# Altium schematic sheet Stepper_motor_driver.SchDoc
size A4; PageSetup: Record=PageOptions|CenterHorizontal=True|CenterVertical=True|PrintScale=1.00|XCorrection=1.00|YCorrection=1.00|PrintKind=0|BorderSize=5000000|LeftOffset=0|BottomOffset=0|Orientation=2|PaperLength=1000|PaperWidth=1000|Scale=100|PaperSource=7|PrintQuality=-3|MediaType=1|DitherType=10|PrintScaleMode=1|PaperKind=A4|PaperIndex=9
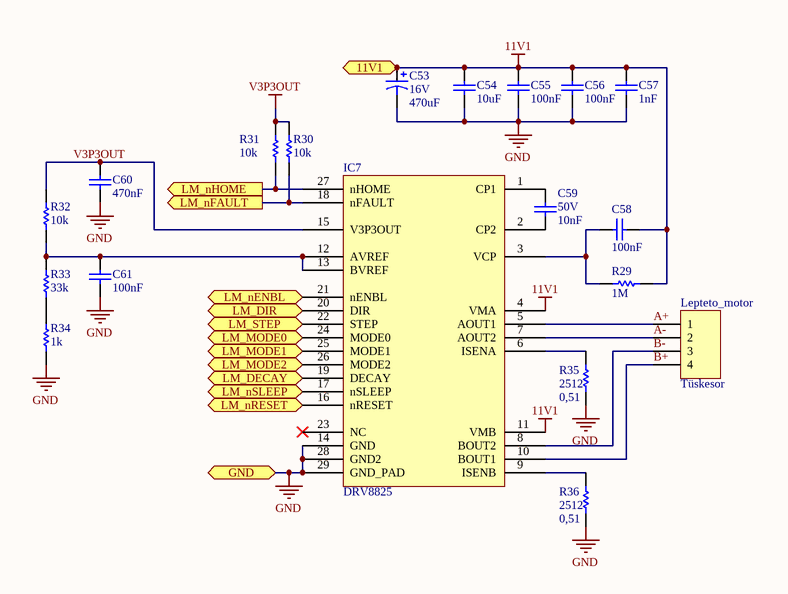
[diagram p0: Stepper_motor_driver.SchDoc]

## Parts
C53  16V  value 470uF  [power_cap_10mm]
C54  value 10uF  [FP_1206_CAP_125]  (hidden comment: 50V)
C55  value 100nF  [FP_0603_CAP_080]  (hidden comment: 50V)
C56  value 100nF  [FP_0603_CAP_080]  (hidden comment: 50V)
C57  value 1nF  [FP_0603_CAP_080]  (hidden comment: 50V)
C58  value 100nF  [FP_0603_CAP_080]  (hidden comment: 16V)
C59  50V  value 10nF  [FP_0603_CAP_080]
C60  value 470nF  [FP_0603_CAP_080]  (hidden comment: 50V)
C61  value 100nF  [FP_0603_CAP_080]  (hidden comment: 50V)
IC7  DRV8825  [TSSOP28_thermal_pad]
Lepteto_motor  Tüskesor  [FP_CONN4_TUSKE_254MM]
R29  value 1M  [FP_0603_RES]  (hidden comment: Res1)
R30  value 10k  [FP_0603_RES]  (hidden comment: Res Semi)
R31  value 10k  [FP_0603_RES]  (hidden comment: Res Semi)
R32  value 10k  [FP_0603_RES]  (hidden comment: Res Semi)
R33  value 33k  [FP_0603_RES]  (hidden comment: Res Semi)
R34  value 1k  [FP_0603_RES]  (hidden comment: Res Semi)
R35  2512  value 0,51  [RES_2512]
R36  2512  value 0,51  [RES_2512]

## Ports
11V1, GND, LM_DECAY (in), LM_DIR (in), LM_MODE0 (in), LM_MODE1 (in), LM_MODE2 (in), LM_nENBL (in), LM_nFAULT (out), LM_nHOME (out), LM_nRESET (in), LM_nSLEEP (in), LM_STEP (in)

## Nets
11V1: C53.1 C54.2 C55.2 C56.2 C57.1 C58.2 IC7.4(VMA) IC7.11(VMB) R29.1 ; port 11V1
GND: C53.2 C54.1 C55.1 C56.1 C57.2 C60.1 C61.1 IC7.14(GND) IC7.28(GND2) IC7.29(GND_PAD) R34.1 R35.1 R36.1 ; port GND
V3P3OUT: C60.2 IC7.15(V3P3OUT) R30.2 R31.2 R32.2
A+: IC7.5(AOUT1) Lepteto_motor.1
A-: IC7.7(AOUT2) Lepteto_motor.2
B+: IC7.10(BOUT1) Lepteto_motor.4
B-: IC7.8(BOUT2) Lepteto_motor.3
LM_DECAY: IC7.19(DECAY) ; port LM_DECAY
LM_DIR: IC7.20(DIR) ; port LM_DIR
LM_MODE0: IC7.24(MODE0) ; port LM_MODE0
LM_MODE1: IC7.25(MODE1) ; port LM_MODE1
LM_MODE2: IC7.26(MODE2) ; port LM_MODE2
LM_nENBL: IC7.21(nENBL) ; port LM_nENBL
LM_nFAULT: IC7.18(nFAULT) R30.1 ; port LM_nFAULT
LM_nHOME: IC7.27(nHOME) R31.1 ; port LM_nHOME
LM_nRESET: IC7.16(nRESET) ; port LM_nRESET
LM_nSLEEP: IC7.17(nSLEEP) ; port LM_nSLEEP
LM_STEP: IC7.22(STEP) ; port LM_STEP
NetC58_1: C58.1 IC7.3(VCP) R29.2
NetC59_1: C59.1 IC7.2(CP2)
NetC59_2: C59.2 IC7.1(CP1)
NetC61_2: C61.2 IC7.12(AVREF) IC7.13(BVREF) R32.1 R33.2
NetIC7_6: IC7.6(ISENA) R35.2
NetIC7_9: IC7.9(ISENB) R36.2
NetR33_1: R33.1 R34.2

Not connected (* = marked no-connect by the designer): IC7 23(NC)*

## Library data of the parts
C53 = Cap Pol1: Polarized Capacitor (Radial); Published: 8-Jun-2000; LatestRevisionDate: 17-Jul-2002; LatestRevisionNote: Re-released for DXP Platform.; PackageReference: RB7.6-15; Publisher: Altium Limited; PackageDescription: Polarized Capacitor (Radial); 2 Leads
C54-C61 = Cap: Capacitor; Published: 8-Jun-2000; LatestRevisionDate: 17-Jul-2002; LatestRevisionNote: Re-released for DXP Platform.; PackageReference: RAD-0.3; Publisher: Altium Limited; PackageDescription: Radial Cap, Thru-Hole; 2 Leads; 0.3 in Pin Spacing
Lepteto_motor = Header 4: Header, 4-Pin; LatestRevisionDate: 17-Jul-2002; LatestRevisionNote: Re-released for DXP Platform.; Publisher: Altium Limited
R29-R36 = Res Semi: Semiconductor Resistor; Published: 8-Jun-2000; LatestRevisionDate: 17-Jul-2002; LatestRevisionNote: Re-released for DXP Platform.; PackageReference: AXIAL-0.5; Publisher: Altium Limited; PackageDescription: Axial Device, Thru-Hole; 2 Leads; 0.5 in Pin Spacing